# EAGLE design Adafruit_BMP085 (EAGLE 5.01)
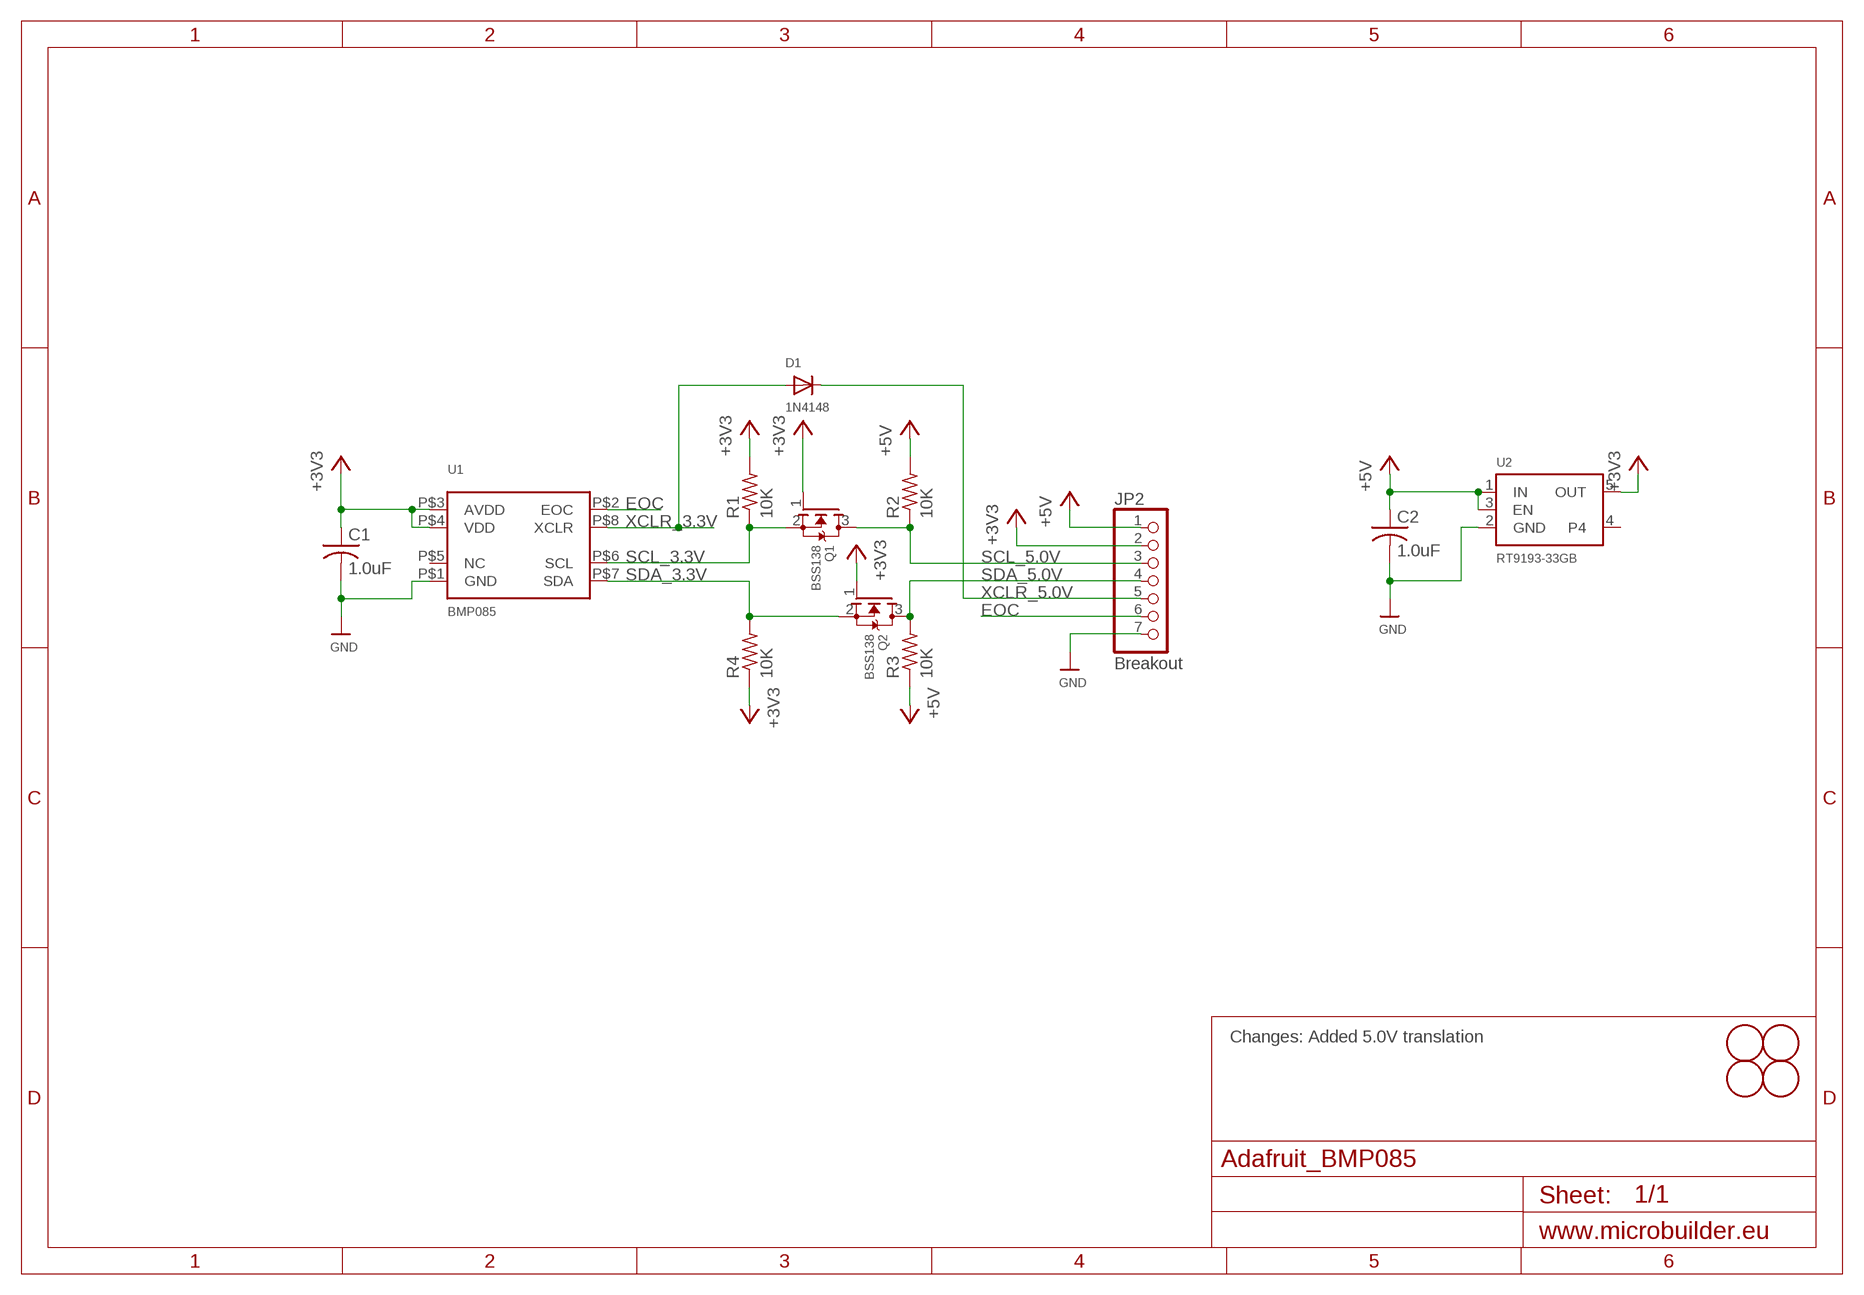
[diagram p0: schematic, sheet 1]

## Parts
C1  1.0uF  C-USC0805  [C0805]
C2  1.0uF  C-USC0805  [C0805]
D1  1N4148  DIODESOD-323F  [SOD-323F]
JP2  Breakout  HEADER-1X7THICKER  [1X07_ROUND_76]
Q1  BSS138  MOSFET-NREFLOW  [SOT23]
Q2  BSS138  MOSFET-NREFLOW  [SOT23]
R1  10K  R-US_R0805  [R0805]
R2  10K  R-US_R0805  [R0805]
R3  10K  R-US_R0805  [R0805]
R4  10K  R-US_R0805  [R0805]
U1  BMP085  [BMP085]
U2  RT9193-33GB  VREG_SOT23-5  [SOT23-5]
U$1  FIDUCIAL  [FIDUCIAL_1MM]
U$7  MOUNTINGHOLE2.0  [MOUNTINGHOLE_2.0_PLATED]
U$8  MOUNTINGHOLE2.0  [MOUNTINGHOLE_2.0_PLATED]
U$15  FIDUCIAL  [FIDUCIAL_1MM]

## Nets
+3V3: C1.1 JP2.2 Q1.1(G) Q2.1(G) R1.2 R4.1 U1.P$3(AVDD) U1.P$4(VDD) U2.5(OUT)
+5V: C2.1 JP2.1 R2.2 R3.1 U2.1(IN) U2.3(EN)
EOC: JP2.6 U1.P$2(EOC)
GND: C1.2 C2.2 JP2.7 U1.P$1(GND) U2.2(GND)
SCL_3.3V: Q1.2(S) R1.1 U1.P$6(SCL)
SCL_5.0V: JP2.3 Q1.3(D) R2.1
SDA_3.3V: Q2.2(S) R4.2 U1.P$7(SDA)
SDA_5.0V: JP2.4 Q2.3(D) R3.2
XCLR_3.3V: D1.A U1.P$8(XCLR)
XCLR_5.0V: D1.C JP2.5
Unconnected: U1.P$5(NC) U2.4

## Notes on the sheet
- Changes: Added 5.0V translation

## Library data of the parts
C1 C2 = adafruit:C-US: CAPACITOR, American symbol
D1 = adafruit:DIODE: Diode SMADIODE - SMA Surface Mount Package 20V 1A Schottky Diode Digikey: 641-1014-6-ND DO-1N4148 - Through Hole Small Current Diode SOD-123 20V 1 A (.5mV Vf) Schottky Diode - Digikey: MBRX120TPMSCT-ND SOD-323 10V 570mA (.38mV Vf, 3ns) Schottky Diode - Digikey: ZLLS410CT-ND SOD-523 30V 30mA Schottky Diode (RB751S-40TE61) - Digikey: RB751S-40TE61CT-ND SOT23-R/W - SOT23 Package (R = Solder Paste/Reflow Ovens, W = Hand-Soldering) BAT54Film 40V 300mA - Digikey: 497-7162-1-ND
JP2 = microbuilder:HEADER-1X7: PIN HEADER
Q1 Q2 = adafruit:MOSFET-N: N-Channel Mosfet 2N7002E - 60V 260mA SOT23 [Digikey: 2N7002ET1GOSTR-ND] - REEL BSH103 - 30V 850mA SOT23 [Digikey: 568-5013-1-ND]
R1-R4 = adafruit:R-US_: RESISTOR, American symbol
U1 = microbuilder:BMP085: BMP085 Digital Pressure Sensor 1.8-3.6V Supply, I2C Interface
U2 = microbuilder:VREG_SOT23-5: SOT23-5 Fixed Voltage Regulators To better organise some of the SOT23-5 fixed voltage regulators in this library, this new part was created. Part Current Out V Out V In V Dropout Digikey Part No. ADP121 150mA 3.3V 3.4-5.5V 0.09V @ 150mA ADP121-AUJZ33R7CT-ND ADP121 150mA 3.0V 3.1-5.5V 0.09V @ 150mA ADP121-AUJZ30R7CT-ND ADP122 300mA 3.3V 3.4-5.5V 0.085V @ 300mA ADP122AUJZ-3.3-R7CT-ND ADP1712 300mA 3.3V 3.5-5.5V 0.17V @ 300mA ADP1712AUJZ-3.3-R7TR-ND LD39015M18R 150mA 1.8V 1.9V-5.5V 0.08V @ 100mA 497-6977-1-ND MCP1824T-3302E/OT 300mA 3.3V 3.5V-6V 0.2V @ 300mA MCP1824T-3302E/OTCT-ND MIC5205-2.5YM5 TR 150mA 2.5V 2.7-16V 0.165V @ 150mA 576-1257-2-ND MIC5205-3.0YM5 TR 150mA 3.0V 3.2V-16V 0.165V @ 150mA 576-1258-2-ND MIC5205-3.3YM5 TR 150mA 3.3V 3.5V-16V 0.165V @ 150mA 576-1259-2-ND TPS780330220 150mA 3.3V+2.2V 3.6-5.5V 250mV Max 296-23332-1-ND TDA3663/N1,135 100mA 3.3V 3.5-45V 0.18V @ 50mA 568-5343-1-ND
U$1 U$15 = adafruit:FIDUCIAL: For use by pick and place machines to calibrate the vision/machine, 1mm By microbuilder.eu
U$7 U$8 = microbuilder:MOUNTINGHOLE: Mounting Hole

## Board
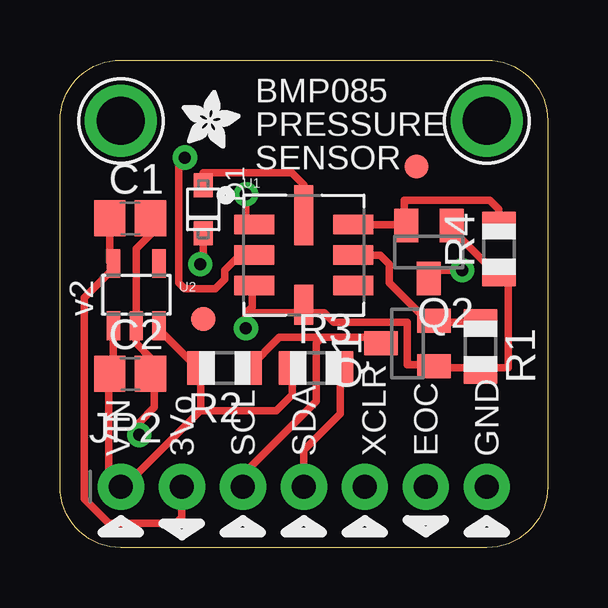
[diagram p1: board, top side]
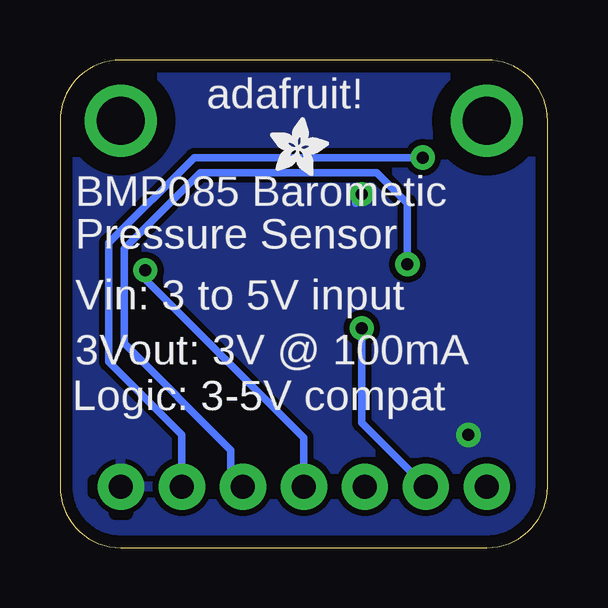
[diagram p2: board, bottom side, seen from below]

Size 20.32 x 20.32 mm. Coordinates in mm from the lower left corner, seen from the top.
Outline: 0,17.78 arc-90 2.54,20.32 17.78,20.32 arc-90 20.32,17.78 20.32,2.54 arc-90 17.78,0 2.54,0 arc-90 0,2.54 0,17.78
Copper layers (1*16): Top 0.035mm / dielectric 1.5mm / Bottom 0.035mm
Design rules "default *": minimum track width 8mil, minimum drill 0.4mm, track to track 8mil, track to pad 8mil, pad to pad 8mil, via to via 8mil, smd to smd 8mil, copper to edge 20mil, drill to drill 8mil, minimum pad ring 8mil, minimum via ring 10mil, stop-mask expansion 3mil, vias tented up to drill 20mil, thermal gap 8mil
bRestrict: area 18.7,2.3 to 18.9,2.8; area 17.5,1.4 to 18,1.7

### Footprints (pad centres in the part's own frame; a part is rotated, then mirrored left to right if it is on the bottom)
C0805 = smd 1.3 x 1.5: 1 -0.85,0; 2 0.85,0
SOD-323F = smd 1 x 0.8: A -1,0; C 1,0
1X07_ROUND_76 = drill 1 pad 1.93 round: 1 -7.62,0; 2 -5.08,0; 3 -2.54,0; 4 0,0; 5 2.54,0; 6 5.08,0; 7 7.62,0
SOT23 = smd 1 x 1.4: 1 -0.95,-1.1; 2 0.95,-1.1; 3 0,1.1
R0805 = smd 1.1 x 1.4: 1 -1,0; 2 1,0
BMP085 = smd 1.67 x 0.8: P$1 -2.065,1.27; P$2 -2.065,0; P$3 -2.065,-1.27; P$5 2.065,-1.27; P$6 2.065,0; P$7 2.065,1.27 | smd 0.8 x 1.67: P$4 0,-2.065 | smd 0.8 x 2.5: P$8 0,1.65
SOT23-5 = smd 0.55 x 1.2: 1 -0.95,-1.3; 2 0,-1.3; 3 0.95,-1.3; 4 0.95,1.3; 5 -0.95,1.3
FIDUCIAL_1MM = smd 1 x 1: 1 0,0
MOUNTINGHOLE_2.0_PLATED = drill 2 pad 3 round: P$1 0,0

### Placement (x,y rotation side)
C1  2.92,13.72 0 top
C2  2.92,7.24 0 top
D1  5.97,14.1 270 top
JP2  10.16,2.54 0 top
Q1  14.48,8.51 90 top
Q2  15.37,12.32 180 top
R1  17.53,8.38 270 top
R2  6.86,7.49 180 top
R3  10.67,7.49 0 top
R4  18.29,12.45 90 top
U1  10.16,12.19 0 top
U2  3.17,10.54 0 top
U$1  5.97,9.53 0 top
U$2  [ADAFRUIT_2.5MM]  11.56,15.49 0 bottom
U$6  [ADAFRUIT_2.5MM]  5.08,16.64 0 top
U$7  2.54,17.78 0 top
U$8  17.78,17.78 0 top
U$15  14.86,15.88 0 top

### Tracks (layer width: path | path; a pad name or v marks a point on that pad's centre or on a via)
+3V3  (via drill 0.5)
  Top 0.305: 17.78,7.49 17.89,7.49 | Q2.1 16.32,13.27 18.03,11.56 18.29,11.56 R4.1 18.29,11.43 18.67,11.43 18.67,7.49 17.78,7.49 | 17.78,7.49 17.8,7.51 | C1.1 2.07,11.9 2.23,11.74 | U1.P$4 10.16,10.16 | 15.62,7.49 15.62,7.47 | 15.62,7.49 15.58,7.45 | 2.23,11.74 U2.5 | 2.23,11.74 2.29,11.68 1.02,10.41 1.02,2.03 2.03,1.02 4.83,1.02 5.08,1.27 JP2.2 5.33,2.79 | U1.P$3 8,10.92 8,10.03 7.75,9.78 | U1.P$4 10.16,9.91 10.03,9.78 7.75,9.78 | U1.P$4 10.16,9.78 11.02,9.78 11.4,9.4 14.48,9.4 14.48,7.62 15.58,7.62 | v7.75,9.14 7.75,9.78 | 17.53,7.49 R1.2 | 17.53,7.49 17.78,7.49 | 15.58,7.62 15.62,7.62 | 15.58,7.62 Q1.1 15.58,7.49 15.62,7.49 | 15.62,7.49 17.53,7.49
  Bottom 0.305: v7.75,9.14 7.75,5.21 JP2.2
+5V
  Top 0.305: 2.07,7.37 1.78,7.37 | 2.07,7.37 C2.1 2.03,7.24 2.03,3.05 JP2.1 2.67,2.54 5.84,5.71 | U2.1 2.23,7.37 2.07,7.37 | R3.1 9.67,6.37 9.02,5.71 5.84,5.71 | 5.84,5.71 5.86,5.73 R2.2 5.71,7.49 4.12,9.08 U2.3
EOC  (via drill 0.5)
  Top 0.305: v5.21,16.26 4.95,16 4.95,11.05 5.21,10.79 6.48,10.79 6.86,11.18 6.86,11.56 7.49,12.19 U1.P$2 8.38,12.19
  Bottom 0.305: JP2.6 15.24,4.7 18.29,7.75 18.29,12.7 14.73,16.26 v5.21,16.26
GND  (via drill 0.5)
  Top 0.305: C2.2 3.81,7.24 | 3.81,7.24 3.81,7.87 3.17,8.51 U2.2 3.17,12.45 3.81,13.08 3.81,13.59 3.94,13.72 C1.2 | 3.81,7.24 3.94,7.11 3.94,5.84 3.3,5.21 v3.3,4.7 | U1.P$1 8,13.46 7.75,13.72 v7.75,14.73
  Bottom 0.305: 8,14.35 8,14.86 7.87,14.73 v7.75,14.73
  pour Bottom (isolate 0.254): 0,20.32 20.32,20.32 20.32,0 0,0
SCL_3.3V
  Top 0.305: U1.P$6 13.34,12.19 13.72,11.81 13.72,11.05 15.37,9.4 15.52,9.4 Q1.2 15.62,9.42 15.62,9.4 15.49,9.4 | 15.49,9.4 15.62,9.27 15.75,9.4 17.53,9.4 R1.1 | 15.49,9.4 15.45,9.44
SCL_5.0V
  Top 0.305: 7.62,2.41 JP2.3 7.62,3.05 10.67,6.1 10.67,8.51 10.92,8.76 | 10.92,8.76 12.95,8.76 | 12.95,8.76 13,8.76 | R2.1 7.86,7.48 9.14,8.76 10.92,8.76 | Q1.3 13.12,8.76 12.95,8.76
SDA_3.3V
  Top 0.305: U1.P$7 14.1,13.46 14.22,13.59 14.35,13.59 | R4.2 18.29,14.1 17.91,14.48 14.35,14.48 14.35,13.59 | 14.42,13.4 14.48,13.34 | 14.42,13.4 Q2.2 | 14.35,13.59 14.35,13.46 14.42,13.4
SDA_5.0V  (via drill 0.5)
  Top 0.305: R3.2 11.67,5.57 10.16,4.06 JP2.4 | v16.76,11.56 15.28,11.56 15.28,11.09 15.37,11.18 Q2.3
  Bottom 0.305: JP2.4 10.16,4.57 16.76,11.18 v16.76,11.56
XCLR_3.3V
  Top 0.305: U1.P$8 10.16,15.11 9.65,15.62 5.97,15.62 D1.A
XCLR_5.0V  (via drill 0.5)
  Top 0.305: 6.1,12.06 v5.84,11.81 5.97,11.81 D1.C
  Bottom 0.305: JP2.5 12.57,2.54 13.21,3.17 13.21,4.06 17.65,8.51 17.65,12.45 14.48,15.62 7.11,15.62 5.84,14.35 v5.84,11.81

### Text on the board
tPlace: BMP085 | PRESSURE | SENSOR | v2 | VIN | 3Vo | SCL | SDA | XCLR | EOC | GND
bPlace: adafruit! | BMP085 Barometic | Pressure Sensor | Vin: 3 to 5V input | 3Vout: 3V @ 100mA | Logic: 3-5V compat